# Altium project AGC_Calibration_Board.PrjPcb
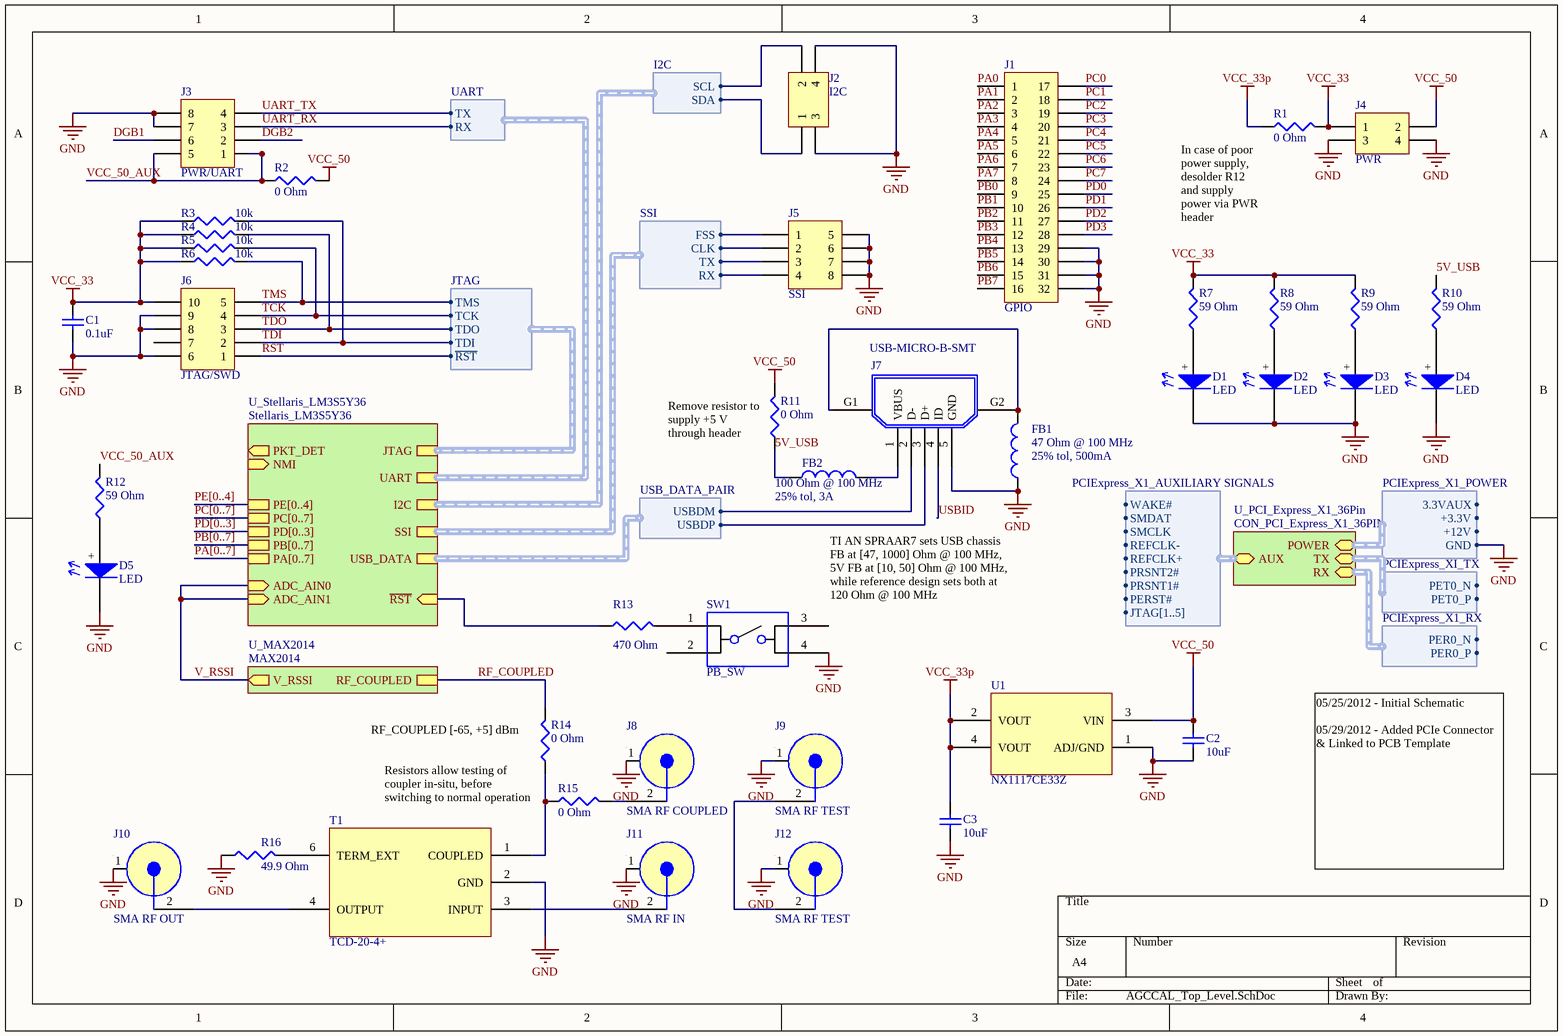
[diagram p0: AGCCAL_Top_Level.SchDoc]
4 sheets, 67 parts. Net scope: hierarchical (ports join the sheet entries above them; power ports are global).
Board file: AGC_Calib_Board.PcbDoc
Sheets:
  AGCCAL_Top_Level.SchDoc
    U_MAX2014 = MAX2014.SchDoc
    U_Stellaris_LM3S5Y36 = Stellaris_LM3S5Y36.SchDoc
    U_PCI_Express_X1_36Pin = CON_PCI_Express_X1_36PIN.SchDoc

## Sheet AGCCAL_Top_Level.SchDoc
size A4

### Parts
(Parts that share a designator on the sheet are numbered #1, #2 ... from top to bottom, then left to right.)
C1#1  value 0.1uF  [1608[0603]]  (hidden comment: Cap Semi)
C2#1  value 10uF  [C1206]  (hidden comment: Cap Semi)
C3#1  value 10uF  [C1206]  (hidden comment: Cap Semi)
D1  LED  [0603_SMT_POLAR]
D2  LED  [0603_SMT_POLAR]
D3  LED  [0603_SMT_POLAR]
D4  LED  [0603_SMT_POLAR]
D5  LED  [0603_SMT_POLAR]
FB1  25% tol, 500mA  value 47 Ohm @ 100 MHz  [0603_SMT]
FB2  25% tol, 3A  value 100 Ohm @ 100 MHz  [0603_SMT]
J1  GPIO  [2.54mm_16x2_HDR]
J2  I2C  [2.54mm_2x2_HDR]
J3  PWR/UART  [1.27mm_2x4_SMT_HDR]
J4  PWR  [HDR2X2]
J5  SSI  [2.54mm_4x2_HDR]
J6  JTAG/SWD  [1.27mm_2x5_SMT_HDR]
J7  USB-MICRO-B-SMT  [USB_MICROB_SMT_R2]
J8  SMA RF COUPLED  [SMA-JACK-THROUGH-MOLEX_5]
J9  SMA RF TEST  [SMA-JACK-THROUGH-MOLEX_5]
J10  SMA RF OUT  [SMA-JACK-THROUGH-MOLEX_5]
J11  SMA RF IN  [SMA-JACK-THROUGH-MOLEX_5]
J12  SMA RF TEST  [SMA-JACK-THROUGH-MOLEX_5]
R1  value 0 Ohm  [0805_SMT]
R2  value 0 Ohm  [0805_SMT]  (hidden comment: Res3)
R3  value 10k  [J1-0603]  (hidden comment: Res3)
R4#1  value 10k  [J1-0603]  (hidden comment: Res3)
R5  value 10k  [J1-0603]  (hidden comment: Res3)
R6#1  value 10k  [J1-0603]  (hidden comment: Res3)
R7#1  value 59 Ohm  [J1-0603]  (hidden comment: Res3)
R8  value 59 Ohm  [J1-0603]  (hidden comment: Res3)
R9  value 59 Ohm  [J1-0603]  (hidden comment: Res3)
R10  value 59 Ohm  [J1-0603]  (hidden comment: Res3)
R11  value 0 Ohm  [0805_SMT]
R12  value 59 Ohm  [J1-0603]  (hidden comment: Res3)
R13  value 470 Ohm  [J1-0603]
R14  value 0 Ohm  [0805_SMT]  (hidden comment: Res3)
R15  value 0 Ohm  [0805_SMT]  (hidden comment: Res3)
R16  value 49.9 Ohm  [0805_SMT]  (hidden comment: Res3)
SW1  PB_SW  [PUSHBUTTON_SW2_SMT]
T1  TCD-20-4+  [DB714-MINICIRCUITS]
U1#1  NX1117CE33Z  [NX1117CE33Z-SOT223]

### Sub-sheets
U_MAX2014 = MAX2014: V_RSSI (out), RF_COUPLED
U_PCI_Express_X1_36Pin = CON_PCI_Express_X1_36PIN: POWER (harness PCIExpress_X1_POWER), TX (harness PCIExpress_XI_TX), AUX (harness PCIExpress_X1_AUXILIARY SIGNALS), RX (harness PCIExpress_X1_RX)
U_Stellaris_LM3S5Y36 = Stellaris_LM3S5Y36: SSI (harness SSI), USB_DATA (harness USB_DATA_PAIR), UART (harness UART), ADC_AIN0 (in), ADC_AIN1 (in), NMI (in), PKT_DET (out), I2C (harness I2C), JTAG (harness JTAG), PA[0..7], PB[0..7], PC[0..7], PD[0..3], PE[0..4], ~{RST} (in)

### Harnesses
JTAG: ~{RST}, TCK, TDI, TDO, TMS
UART: RX, TX
I2C: SCL, SDA
SSI: FSS, CLK, TX, RX
USB_DATA_PAIR: USBDM, USBDP
PCIExpress_XI_TX: PET0_N, PET0_P
PCIExpress_X1_RX: PER0_N, PER0_P
PCIExpress_X1_POWER: 3.3VAUX, +3.3V, +12V, GND
PCIExpress_X1_AUXILIARY SIGNALS: JTAG[1..5], PERST#, PRSNT1#, PRSNT2#, REFCLK+, REFCLK-, SMCLK, SMDAT, WAKE#

### Nets
GND: C1#1.1 C2#1.1 C3#1.1 D1.-(Cathode) D2.-(Cathode) D3.-(Cathode) D4.-(Cathode) D5.-(Cathode) FB1.1 J1.29 J1.30 J1.31 J1.32 J2.3 J2.4 J3.7 J3.8 J4.3 J4.4 J5.5 J5.6 J5.7 J5.8 J6.6 J6.8 J6.9 J7.5(GND) J8.1(GND) J9.1(GND) J10.1(GND) J11.1(GND) J12.1(GND) R16.1 SW1.4 T1.2(GND) U1#1.1(ADJ/GND) ; sheet U_PCI_Express_X1_36Pin/POWER.GND
VCC_33: C1#1.2 J4.1 J6.10 R1.2 R3.1 R4#1.1 R5.1 R6#1.1 R7#1.2 R8.2 R9.2
VCC_33p: C3#1.2 R1.1 U1#1.2(VOUT) U1#1.4(VOUT)
VCC_50: C2#1.2 J4.2 R2.2 R11.2 U1#1.3(VIN)
5V_USB: FB2.1 R10.2 R11.1
~{RST}: J6.1 R13.1 ; sheet U_Stellaris_LM3S5Y36/~{RST}, sheet U_Stellaris_LM3S5Y36/JTAG.~{RST}
DGB1: J3.6
DGB2: J3.2
PA0: J1.1 J3.3 ; sheet U_Stellaris_LM3S5Y36/UART.RX  [also labelled UART_RX]
PA1: J1.2 J3.4 ; sheet U_Stellaris_LM3S5Y36/UART.TX  [also labelled UART_TX]
PA2: J1.3 J5.2 ; sheet U_Stellaris_LM3S5Y36/SSI.CLK
PA3: J1.4 J5.1 ; sheet U_Stellaris_LM3S5Y36/SSI.FSS
PA4: J1.5 J5.4 ; sheet U_Stellaris_LM3S5Y36/SSI.RX
PA5: J1.6 J5.3 ; sheet U_Stellaris_LM3S5Y36/SSI.TX
PA6: J1.7
PA7: J1.8
PB0: J1.9 ; sheet U_Stellaris_LM3S5Y36/PKT_DET
PB1: J1.10
PB2: J1.11 J2.2 ; sheet U_Stellaris_LM3S5Y36/I2C.SCL
PB3: J1.12 J2.1 ; sheet U_Stellaris_LM3S5Y36/I2C.SDA
PB4: J1.13
PB5: J1.14
PB6: J1.15
PB7: J1.16 ; sheet U_Stellaris_LM3S5Y36/NMI
PC0: J1.17 J6.4 R5.2 ; sheet U_Stellaris_LM3S5Y36/JTAG.TCK  [also labelled TCK]
PC1: J1.18 J6.5 R6#1.2 ; sheet U_Stellaris_LM3S5Y36/JTAG.TMS  [also labelled TMS]
PC2: J1.19 J6.2 R3.2 ; sheet U_Stellaris_LM3S5Y36/JTAG.TDI  [also labelled TDI]
PC3: J1.20 J6.3 R4#1.2 ; sheet U_Stellaris_LM3S5Y36/JTAG.TDO  [also labelled TDO]
PC4: J1.21
PC5: J1.22
PC6: J1.23
PC7: J1.24
PD0: J1.25
PD1: J1.26
PD2: J1.27
PD3: J1.28
RF_COUPLED: R14.2 ; sheet U_MAX2014/RF_COUPLED
USB0D_N: J7.2(D-) ; sheet U_Stellaris_LM3S5Y36/USB_DATA.USBDM
USB0D_P: J7.3(D+) ; sheet U_Stellaris_LM3S5Y36/USB_DATA.USBDP
USBID: J7.4(ID)
V_RSSI: sheet U_MAX2014/V_RSSI, sheet U_Stellaris_LM3S5Y36/ADC_AIN0, sheet U_Stellaris_LM3S5Y36/ADC_AIN1  [project net PE2]
VCC_50_AUX: J3.1 J3.5 R2.1 R12.2
NetD1_+: D1.+(Anode) R7#1.1
NetD2_+: D2.+(Anode) R8.1
NetD3_+: D3.+(Anode) R9.1
NetD4_+: D4.+(Anode) R10.1
NetD5_+: D5.+(Anode) R12.1
NetFB1_2: FB1.2 J7.G1 J7.G2
NetFB2_2: FB2.2 J7.1(VBUS)
NetJ8_2: J8.2 R15.2
NetJ9_2: J9.2 J12.2
NetJ10_2: J10.2 T1.4(OUTPUT)
NetJ11_2: J11.2 T1.3(INPUT)
NetR13_2: R13.2 SW1.1
NetR14_1: R14.1 R15.1 T1.1(COUPLED)
NetR16_2: R16.2 T1.6(TERM_EXT)

Not connected (* = marked no-connect by the designer): J6 7; SW1 2 3; T1 5(NOT_USED)

### Buses and harness runs
bus PA[0..7] = sheet U_Stellaris_LM3S5Y36/PA[0..7]
bus PB[0..7] = sheet U_Stellaris_LM3S5Y36/PB[0..7]
bus PC[0..7] = sheet U_Stellaris_LM3S5Y36/PC[0..7]
bus PD[0..3] = sheet U_Stellaris_LM3S5Y36/PD[0..3]
bus PE[0..4] = sheet U_Stellaris_LM3S5Y36/PE[0..4]

### Notes on the sheet
- (near R1) Text
- (near R1) In case of poor power supply, desolder R12 and supply power via PWR header
- (near R11) Remove resistor to supply +5 V through header
- TI AN SPRAAR7 sets USB chassis FB at [47, 1000] Ohm @ 100 MHz, 5V FB at [10, 50] Ohm @ 100 MHz, while reference design sets both at 120 Ohm @ 100 MHz
- (near R14) RF_COUPLED [-65, +5] dBm
- (near R14) Resistors allow testing of coupler in-situ, before switching to normal operation
- 05/25/2012 - Initial Schematic
  05/29/2012 - Added PCIe Connector & Linked to PCB Template

### Library data of the parts
C1#1 C2#1 C3#1 = Cap Semi: Capacitor (Semiconductor SIM Model); Published: 8-Jun-2000; LatestRevisionDate: 29-May-2009; LatestRevisionNote: IPC-7351 Footprint Added.; PackageReference: C1206; Publisher: Altium Limited; PackageDescription: Chip Capacitor
FB1 FB2 = Inductor: Code_IEC: 1005; Published: 8-Jun-2000; LatestRevisionDate: 29-May-2009; LatestRevisionNote: IPC-7351 Footprint Added.; PackageReference: 0402-A; Publisher: Altium Limited; PackageDescription: Chip Inductor; Code_JEITA: 0402
J1 = Header 16X2A: Header, 16-Pin, Dual row; LatestRevisionDate: 17-Jul-2002; LatestRevisionNote: Re-released for DXP Platform.; Publisher: Altium Limited
J2 J4 = Header 2X2: Header, 2-Pin, Dual row; LatestRevisionDate: 17-Jul-2002; LatestRevisionNote: Re-released for DXP Platform.; Publisher: Altium Limited
J3 J5 = Header 4X2A: Header, 4-Pin, Dual row; LatestRevisionDate: 17-Jul-2002; LatestRevisionNote: Re-released for DXP Platform.; Publisher: Altium Limited
J6 = Header 5X2A: Header, 5-Pin, Dual row; LatestRevisionDate: 17-Jul-2002; LatestRevisionNote: Re-released for DXP Platform.; Publisher: Altium Limited
J8 = SMA-THROUGH-MOUNT: RF Coupled
J9-J12 = SMA-THROUGH-MOUNT
R1-R3 R4#1 R5 R6#1 R7#1 R8-R16 = Res3: Resistor; Published: 8-Jun-2000; LatestRevisionDate: 29-May-2009; LatestRevisionNote: IPC-7351 Footprint Added.; PackageReference: J1-0603; Publisher: Altium Limited; PackageDescription: Chip Resistor
SW1 = SMT-PUSHBUTTON-SW: Pushbutton Switch

## Sheet MAX2014.SchDoc
size A
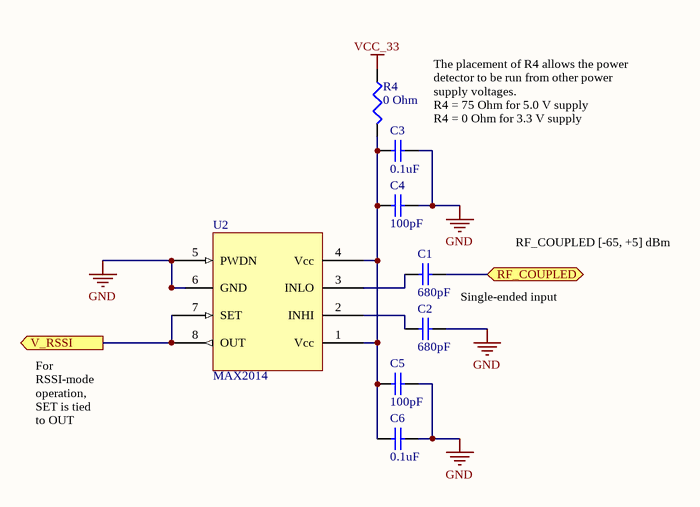
[diagram p1: MAX2014.SchDoc]

### Parts
(Parts that share a designator on the sheet are numbered #1, #2 ... from top to bottom, then left to right.)
C1#2  value 680pF  [1608[0603]]  (hidden comment: Cap Semi)
C2#2  value 680pF  [1608[0603]]  (hidden comment: Cap Semi)
C3#2  value 0.1uF  [1608[0603]]  (hidden comment: Cap Semi)
C4  value 100pF  [1608[0603]]  (hidden comment: Cap Semi)
C5  value 100pF  [1608[0603]]  (hidden comment: Cap Semi)
C6  value 0.1uF  [1608[0603]]  (hidden comment: Cap Semi)
R4#2  value 0 Ohm  [0805_SMT]  (hidden comment: Res3)
U2  MAX2014  [uMAX-8]

### Ports
RF_COUPLED, V_RSSI (out)

### Nets
GND: C2#2.2 C3#2.1 C4.1 C5.1 C6.1 U2.5(PWDN) U2.6(GND)
VCC_33: R4#2.1
PE2: U2.7(SET) U2.8(OUT) ; port V_RSSI
RF_COUPLED: C1#2.2 ; port RF_COUPLED
NetC1#2_1: C1#2.1 U2.3(INLO)
NetC2#2_1: C2#2.1 U2.2(INHI)
NetC3#2_2: C3#2.2 C4.2 C5.2 C6.2 R4#2.2 U2.1(Vcc) U2.4(Vcc)

### Notes on the sheet
- (near C3#2) The placement of R4 allows the power detector to be run from other power supply voltages.
  R4 = 75 Ohm for 5.0 V supply
  R4 = 0 Ohm for 3.3 V supply
- RF_COUPLED [-65, +5] dBm
- Single-ended input
- For RSSI-mode operation, SET is tied to OUT

### Library data of the parts
C1#2 C2#2 C3#2 C4-C6 = Cap Semi: Capacitor (Semiconductor SIM Model); Published: 8-Jun-2000; LatestRevisionDate: 29-May-2009; LatestRevisionNote: IPC-7351 Footprint Added.; PackageReference: C1206; Publisher: Altium Limited; PackageDescription: Chip Capacitor
R4#2 = Res3: Resistor; Published: 8-Jun-2000; LatestRevisionDate: 29-May-2009; LatestRevisionNote: IPC-7351 Footprint Added.; PackageReference: J1-0603; Publisher: Altium Limited; PackageDescription: Chip Resistor

## Sheet Stellaris_LM3S5Y36.SchDoc
size A3
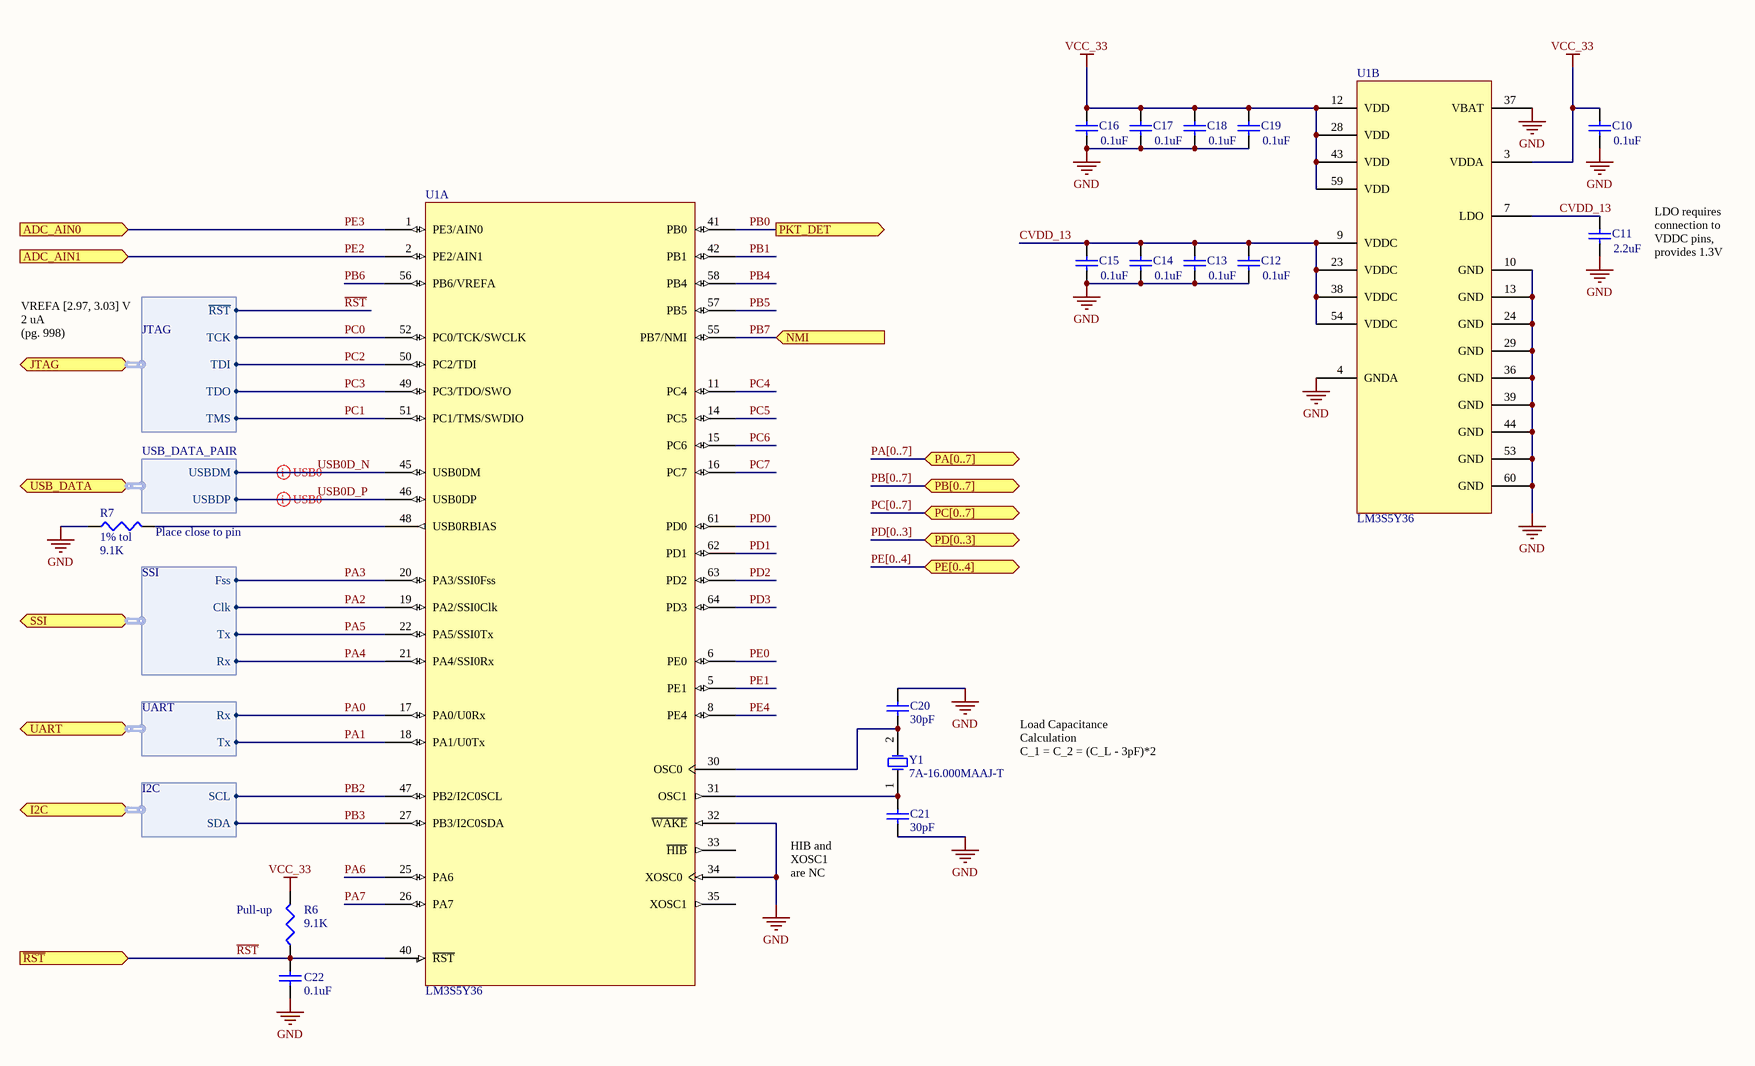
[diagram p2: Stellaris_LM3S5Y36.SchDoc]

### Parts
(Parts that share a designator on the sheet are numbered #1, #2 ... from top to bottom, then left to right.)
C10  value 0.1uF  [1608[0603]]  (hidden comment: Cap)
C11  value 2.2uF  [1608[0603]]  (hidden comment: Cap)
C12  value 0.1uF  [1608[0603]]  (hidden comment: Cap)
C13  value 0.1uF  [1608[0603]]  (hidden comment: Cap)
C14  value 0.1uF  [1608[0603]]  (hidden comment: Cap)
C15  value 0.1uF  [1608[0603]]  (hidden comment: Cap)
C16  value 0.1uF  [1608[0603]]  (hidden comment: Cap)
C17  value 0.1uF  [1608[0603]]  (hidden comment: Cap)
C18  value 0.1uF  [1608[0603]]  (hidden comment: Cap)
C19  value 0.1uF  [1608[0603]]  (hidden comment: Cap)
C20  value 30pF  [1608[0603]]  (hidden comment: Cap Semi)
C21  value 30pF  [1608[0603]]  (hidden comment: Cap Semi)
C22  value 0.1uF  [1608[0603]]  (hidden comment: Cap Semi)
R6#2  value 9.1K  [J1-0603]  (hidden comment: 1% tol)
R7#2  1% tol  value 9.1K  [J1-0603]
U1#2  LM3S5Y36  [PQFP-64-TI_Stellaris]  (parts A,B of 2)
Y1  7A-16.000MAAJ-T  [XTAL_SMT_5_3-2]

### Ports
ADC_AIN0 (in), ADC_AIN1 (in), I2C (harness I2C), JTAG (harness JTAG), NMI (in), PA[0..7], PB[0..7], PC[0..7], PD[0..3], PE[0..4], PKT_DET (out), SSI (harness SSI), UART (harness UART), USB_DATA (harness USB_DATA_PAIR), ~{RST} (in)

### Harnesses
JTAG: TCK, TDI, TDO, TMS, ~{RST}
SSI: Fss, Clk, Tx, Rx
UART: Rx, Tx
I2C: SCL, SDA
USB_DATA_PAIR: USBDM, USBDP

### Nets
GND: C10.1 C11.1 C12.1 C13.1 C14.1 C15.1 C16.1 C17.1 C18.1 C19.1 C20.2 C21.1 C22.1 R7#2.1 U1#2.4(GNDA) U1#2.10(GND) U1#2.13(GND) U1#2.24(GND) U1#2.29(GND) U1#2.32(~{WAKE}) U1#2.34(XOSC0) U1#2.36(GND) U1#2.37(VBAT) U1#2.39(GND) U1#2.44(GND) U1#2.53(GND) U1#2.60(GND)
VCC_33: C10.2 C16.2 C17.2 C18.2 C19.2 R6#2.2 U1#2.3(VDDA) U1#2.12(VDD) U1#2.28(VDD) U1#2.43(VDD) U1#2.59(VDD)
~{RST}: C22.2 R6#2.1 U1#2.40(~{RST}) ; port ~{RST}, port JTAG.~{RST}
CVDD_13: C11.2 C12.2 C13.2 C14.2 C15.2 U1#2.7(LDO) U1#2.9(VDDC) U1#2.23(VDDC) U1#2.38(VDDC) U1#2.54(VDDC)
PA0: U1#2.17(PA0/U0Rx) ; port UART.Rx
PA1: U1#2.18(PA1/U0Tx) ; port UART.Tx
PA2: U1#2.19(PA2/SSI0Clk) ; port SSI.Clk
PA3: U1#2.20(PA3/SSI0Fss) ; port SSI.Fss
PA4: U1#2.21(PA4/SSI0Rx) ; port SSI.Rx
PA5: U1#2.22(PA5/SSI0Tx) ; port SSI.Tx
PA6: U1#2.25(PA6)
PA7: U1#2.26(PA7)
PB0: U1#2.41(PB0) ; port PKT_DET
PB1: U1#2.42(PB1)
PB2: U1#2.47(PB2/I2C0SCL) ; port I2C.SCL
PB3: U1#2.27(PB3/I2C0SDA) ; port I2C.SDA
PB4: U1#2.58(PB4)
PB5: U1#2.57(PB5)
PB6: U1#2.56(PB6/VREFA)
PB7: U1#2.55(PB7/NMI) ; port NMI
PC0: U1#2.52(PC0/TCK/SWCLK) ; port JTAG.TCK
PC1: U1#2.51(PC1/TMS/SWDIO) ; port JTAG.TMS
PC2: U1#2.50(PC2/TDI) ; port JTAG.TDI
PC3: U1#2.49(PC3/TDO/SWO) ; port JTAG.TDO
PC4: U1#2.11(PC4)
PC5: U1#2.14(PC5)
PC6: U1#2.15(PC6)
PC7: U1#2.16(PC7)
PD0: U1#2.61(PD0)
PD1: U1#2.62(PD1)
PD2: U1#2.63(PD2)
PD3: U1#2.64(PD3)
PE0: U1#2.6(PE0)
PE1: U1#2.5(PE1)
PE2: U1#2.1(PE3/AIN0) U1#2.2(PE2/AIN1) ; port ADC_AIN0, port ADC_AIN1  [also labelled PE3]
PE4: U1#2.8(PE4)
USB0D_N: U1#2.45(USB0DM) ; port USB_DATA.USBDM
USB0D_P: U1#2.46(USB0DP) ; port USB_DATA.USBDP
NetC20_1: C20.1 U1#2.30(OSC0) Y1.2(OSC2)
NetC21_2: C21.2 U1#2.31(OSC1) Y1.1(OSC1)
NetR7#2_2: R7#2.2 U1#2.48(USB0RBIAS)

Not connected (* = marked no-connect by the designer): U1#2 33(~{HIB}) 35(XOSC1)

### Buses and harness runs
bus PA[0..7] = port PA[0..7]
bus PB[0..7] = port PB[0..7]
bus PC[0..7] = port PC[0..7]
bus PD[0..3] = port PD[0..3]
bus PE[0..4] = port PE[0..4]

### Layout directives
differential pair: USB0D_N, USB0D_P

### Notes on the sheet
- LDO requires connection to VDDC pins, provides 1.3V
- VREFA [2.97, 3.03] V
  2 uA
  (pg. 998)
- (near R7#2) Place close to pin
- Load Capacitance Calculation
  C_1 = C_2 = (C_L - 3pF)*2
  (TI spma036 pg. 6)
- (near R6#2) Pull-up
- HIB and XOSC1 are NC

### Library data of the parts
C10-C22 = Cap Semi: Capacitor (Semiconductor SIM Model); Published: 8-Jun-2000; LatestRevisionDate: 29-May-2009; LatestRevisionNote: IPC-7351 Footprint Added.; PackageReference: C1206; Publisher: Altium Limited; PackageDescription: Chip Capacitor
R6#2 R7#2 = Res3: Resistor; Published: 8-Jun-2000; LatestRevisionDate: 29-May-2009; LatestRevisionNote: IPC-7351 Footprint Added.; PackageReference: J1-0603; Publisher: Altium Limited; PackageDescription: Chip Resistor
U1#2 = LM3S5Y36: TI Stellaris LM3S5Y36 Microcontroller
Y1 = XTAL: Crystal Oscillator; Published: 8-Jun-2000; LatestRevisionDate: 17-Jul-2002; LatestRevisionNote: Re-released for DXP Platform.; PackageReference: R38; Publisher: Altium Limited; PackageDescription: Crystal, Thru-Hole; 2 Leads; Body 3.1 x 8.2 mm (Dia.xH)

## Sheet CON_PCI_Express_X1_36PIN.SchDoc: PCI Express x1 36Pin
size A4
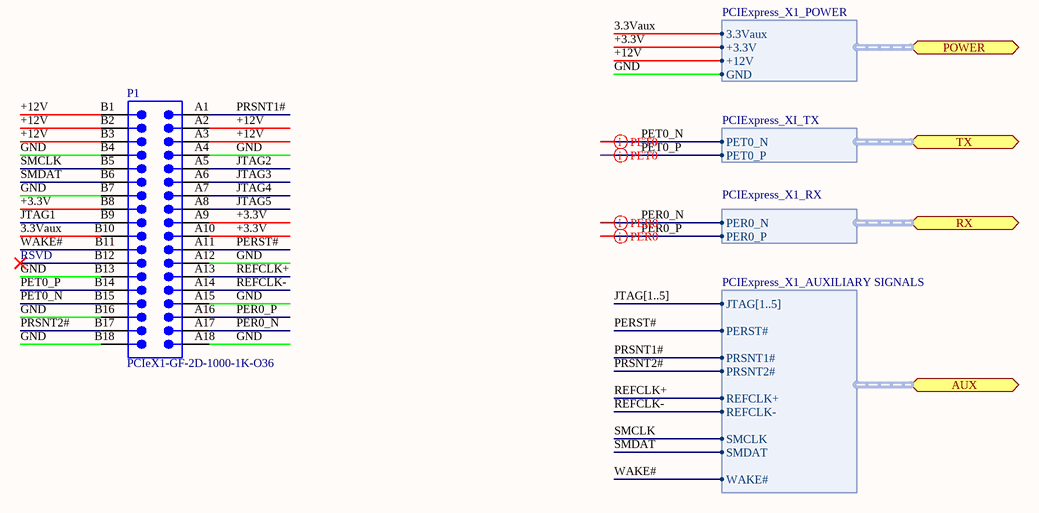
[diagram p3: CON_PCI_Express_X1_36PIN.SchDoc]

### Parts
P1  PCIeX1-GF-2D-1000-1K-O36  [PCIeX1-GF-2D-1000-1K-O36]  (no BOM)

### Ports
AUX (harness PCIExpress_X1_AUXILIARY SIGNALS), POWER (harness PCIExpress_X1_POWER), RX (harness PCIExpress_X1_RX), TX (harness PCIExpress_XI_TX)

### Harnesses
PCIExpress_X1_RX: PER0_N, PER0_P
PCIExpress_XI_TX: PET0_N, PET0_P
PCIExpress_X1_POWER: +3.3V, +12V, GND, 3.3Vaux
PCIExpress_X1_AUXILIARY SIGNALS: JTAG[1..5], PERST#, PRSNT1#, PRSNT2#, REFCLK+, REFCLK-, SMCLK, SMDAT, WAKE#

### Nets
GND: P1.A4 P1.A12 P1.A15 P1.A18 P1.B4 P1.B7 P1.B13 P1.B16 P1.B18 ; port POWER.GND
3.3Vaux: P1.B10 ; port POWER.3.3Vaux
+3.3V: P1.A9 P1.A10 P1.B8 ; port POWER.+3.3V
+12V: P1.A2 P1.A3 P1.B1 P1.B2 P1.B3 ; port POWER.+12V
JTAG1: P1.B9
JTAG2: P1.A5
JTAG3: P1.A6
JTAG4: P1.A7
JTAG5: P1.A8
PER0_N: P1.A17 ; port RX.PER0_N
PER0_P: P1.A16 ; port RX.PER0_P
PERST#: P1.A11 ; port AUX.PERST#
PET0_N: P1.B15 ; port TX.PET0_N
PET0_P: P1.B14 ; port TX.PET0_P
PRSNT1#: P1.A1 ; port AUX.PRSNT1#
PRSNT2#: P1.B17 ; port AUX.PRSNT2#
REFCLK+: P1.A13 ; port AUX.REFCLK+
REFCLK-: P1.A14 ; port AUX.REFCLK-
SMCLK: P1.B5 ; port AUX.SMCLK
SMDAT: P1.B6 ; port AUX.SMDAT
WAKE#: P1.B11 ; port AUX.WAKE#

Not connected (* = marked no-connect by the designer): P1 B12*

### Buses and harness runs
bus JTAG[1..5]

### Layout directives
differential pair: PER0_N, PER0_P, PET0_N, PET0_P

### Notes on the sheet
- RSVD
- Sheet Title
- Project Title
- Size:
- Date:
- A4
- Item:
- Time:
- Revision:
- Sheet
- of
- File:

### Library data of the parts
P1 = CMP-0001-00030-2: Golden finger, PCIeX1, Dual, Opposite, Pitch 1mm, 36-Position; Mating Connector: Molex-87715-9006; Package Reference: PCIeX1-GF-2D-1000-1K-O36; ClassName: Edge Connector; Publisher: Altium; Datasheet Version: rev2.0, Apr-2007

## Nets that join several sheets
GND: AGCCAL_Top_Level (36 pins), MAX2014 (7 pins), Stellaris_LM3S5Y36 (27 pins), CON_PCI_Express_X1_36PIN (9 pins)
VCC_33: AGCCAL_Top_Level (11 pins), MAX2014 (R4#2.1), Stellaris_LM3S5Y36 (11 pins)
~{RST}: AGCCAL_Top_Level (J6.1 R13.1), Stellaris_LM3S5Y36 (C22.2 R6#2.1 U1#2.40)
PA0: AGCCAL_Top_Level (J1.1 J3.3), Stellaris_LM3S5Y36 (U1#2.17)
PA1: AGCCAL_Top_Level (J1.2 J3.4), Stellaris_LM3S5Y36 (U1#2.18)
PA2: AGCCAL_Top_Level (J1.3 J5.2), Stellaris_LM3S5Y36 (U1#2.19)
PA3: AGCCAL_Top_Level (J1.4 J5.1), Stellaris_LM3S5Y36 (U1#2.20)
PA4: AGCCAL_Top_Level (J1.5 J5.4), Stellaris_LM3S5Y36 (U1#2.21)
PA5: AGCCAL_Top_Level (J1.6 J5.3), Stellaris_LM3S5Y36 (U1#2.22)
PA6: AGCCAL_Top_Level (J1.7), Stellaris_LM3S5Y36 (U1#2.25)
PA7: AGCCAL_Top_Level (J1.8), Stellaris_LM3S5Y36 (U1#2.26)
PB0: AGCCAL_Top_Level (J1.9), Stellaris_LM3S5Y36 (U1#2.41)
PB1: AGCCAL_Top_Level (J1.10), Stellaris_LM3S5Y36 (U1#2.42)
PB2: AGCCAL_Top_Level (J1.11 J2.2), Stellaris_LM3S5Y36 (U1#2.47)
PB3: AGCCAL_Top_Level (J1.12 J2.1), Stellaris_LM3S5Y36 (U1#2.27)
PB4: AGCCAL_Top_Level (J1.13), Stellaris_LM3S5Y36 (U1#2.58)
PB5: AGCCAL_Top_Level (J1.14), Stellaris_LM3S5Y36 (U1#2.57)
PB6: AGCCAL_Top_Level (J1.15), Stellaris_LM3S5Y36 (U1#2.56)
PB7: AGCCAL_Top_Level (J1.16), Stellaris_LM3S5Y36 (U1#2.55)
PC0: AGCCAL_Top_Level (J1.17 J6.4 R5.2), Stellaris_LM3S5Y36 (U1#2.52)
PC1: AGCCAL_Top_Level (J1.18 J6.5 R6#1.2), Stellaris_LM3S5Y36 (U1#2.51)
PC2: AGCCAL_Top_Level (J1.19 J6.2 R3.2), Stellaris_LM3S5Y36 (U1#2.50)
PC3: AGCCAL_Top_Level (J1.20 J6.3 R4#1.2), Stellaris_LM3S5Y36 (U1#2.49)
PC4: AGCCAL_Top_Level (J1.21), Stellaris_LM3S5Y36 (U1#2.11)
PC5: AGCCAL_Top_Level (J1.22), Stellaris_LM3S5Y36 (U1#2.14)
PC6: AGCCAL_Top_Level (J1.23), Stellaris_LM3S5Y36 (U1#2.15)
PC7: AGCCAL_Top_Level (J1.24), Stellaris_LM3S5Y36 (U1#2.16)
PD0: AGCCAL_Top_Level (J1.25), Stellaris_LM3S5Y36 (U1#2.61)
PD1: AGCCAL_Top_Level (J1.26), Stellaris_LM3S5Y36 (U1#2.62)
PD2: AGCCAL_Top_Level (J1.27), Stellaris_LM3S5Y36 (U1#2.63)
PD3: AGCCAL_Top_Level (J1.28), Stellaris_LM3S5Y36 (U1#2.64)
PE2: MAX2014 (U2.7 U2.8), Stellaris_LM3S5Y36 (U1#2.1 U1#2.2)
RF_COUPLED: AGCCAL_Top_Level (R14.2), MAX2014 (C1#2.2)
USB0D_N: AGCCAL_Top_Level (J7.2), Stellaris_LM3S5Y36 (U1#2.45)
USB0D_P: AGCCAL_Top_Level (J7.3), Stellaris_LM3S5Y36 (U1#2.46)